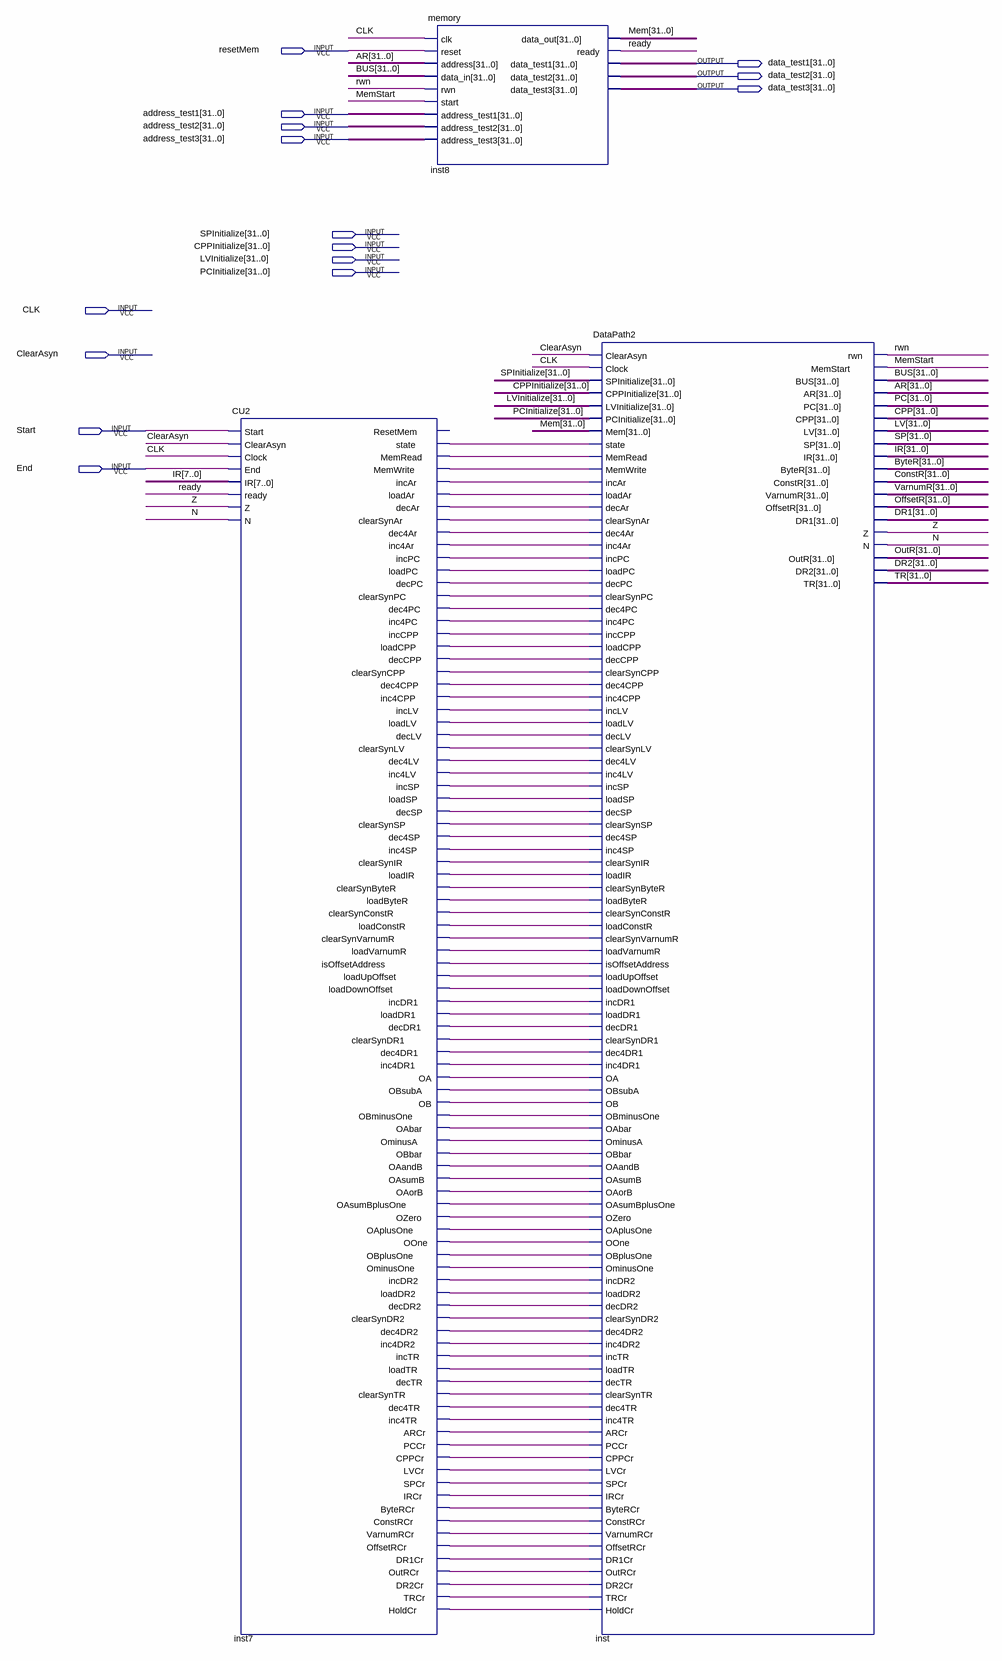
[diagram p0: schematic sheet]
// Quartus schematic cpu3.bdf as structural Verilog: 3 symbols, 15 pins
module cpu3 (
  input  resetMem,
  input  [31:0] address_test1,
  input  [31:0] address_test2,
  input  [31:0] address_test3,
  input  [31:0] SPInitialize,
  input  [31:0] CPPInitialize,
  input  [31:0] LVInitialize,
  input  [31:0] PCInitialize,
  input  CLK,
  input  ClearAsyn,
  input  Start,
  input  End,
  output [31:0] data_test1,
  output [31:0] data_test2,
  output [31:0] data_test3
);

  wire inst7_arcr, inst7_bytercr, inst7_clearsynar, inst7_clearsynbyter, inst7_clearsynconstr,
       inst7_clearsyncpp, inst7_clearsyndr1, inst7_clearsyndr2, inst7_clearsynir, inst7_clearsynlv,
       inst7_clearsynpc, inst7_clearsynsp, inst7_clearsyntr, inst7_clearsynvarnumr, inst7_constrcr,
       inst7_cppcr, inst7_dec4ar, inst7_dec4cpp, inst7_dec4dr1, inst7_dec4dr2, inst7_dec4lv, inst7_dec4pc,
       inst7_dec4sp, inst7_dec4tr, inst7_decar, inst7_deccpp, inst7_decdr1, inst7_decdr2, inst7_declv,
       inst7_decpc, inst7_decsp, inst7_dectr, inst7_dr1cr, inst7_dr2cr, inst7_holdcr, inst7_inc4ar,
       inst7_inc4cpp, inst7_inc4dr1, inst7_inc4dr2, inst7_inc4lv, inst7_inc4pc, inst7_inc4sp, inst7_inc4tr,
       inst7_incar, inst7_inccpp, inst7_incdr1, inst7_incdr2, inst7_inclv, inst7_incpc, inst7_incsp,
       inst7_inctr, inst7_ircr, inst7_isoffsetaddress, inst7_loadar, inst7_loadbyter, inst7_loadconstr,
       inst7_loadcpp, inst7_loaddownoffset, inst7_loaddr1, inst7_loaddr2, inst7_loadir, inst7_loadlv,
       inst7_loadpc, inst7_loadsp, inst7_loadtr, inst7_loadupoffset, inst7_loadvarnumr, inst7_lvcr,
       inst7_memread, inst7_memwrite, inst7_oa, inst7_oaandb, inst7_oabar, inst7_oaorb, inst7_oaplusone,
       inst7_oasumb, inst7_oasumbplusone, inst7_ob, inst7_obbar, inst7_obminusone, inst7_obplusone,
       inst7_obsuba, inst7_offsetrcr, inst7_ominusa, inst7_ominusone, inst7_oone, inst7_outrcr, inst7_ozero,
       inst7_pccr, inst7_spcr, inst7_state, inst7_trcr, inst7_varnumrcr, MemStart, N, ready, rwn, Z;
  wire [31:0] AR, BUS, ByteR, ConstR, CPP, DR1, DR2, IR, LV, Mem, OffsetR, OutR, PC, SP, TR, VarnumR;

  CU2 inst7 (
    .Start(Start), .ClearAsyn(ClearAsyn), .Clock(CLK), .End(End), .IR(IR[7:0]), .ready(ready), .Z(Z), .N(N),
    .state(inst7_state), .MemRead(inst7_memread), .MemWrite(inst7_memwrite), .incAr(inst7_incar),
    .loadAr(inst7_loadar), .decAr(inst7_decar), .clearSynAr(inst7_clearsynar), .dec4Ar(inst7_dec4ar),
    .inc4Ar(inst7_inc4ar), .incPC(inst7_incpc), .loadPC(inst7_loadpc), .decPC(inst7_decpc),
    .clearSynPC(inst7_clearsynpc), .dec4PC(inst7_dec4pc), .inc4PC(inst7_inc4pc), .incCPP(inst7_inccpp),
    .loadCPP(inst7_loadcpp), .decCPP(inst7_deccpp), .clearSynCPP(inst7_clearsyncpp), .dec4CPP(inst7_dec4cpp),
    .inc4CPP(inst7_inc4cpp), .incLV(inst7_inclv), .loadLV(inst7_loadlv), .decLV(inst7_declv),
    .clearSynLV(inst7_clearsynlv), .dec4LV(inst7_dec4lv), .inc4LV(inst7_inc4lv), .incSP(inst7_incsp),
    .loadSP(inst7_loadsp), .decSP(inst7_decsp), .clearSynSP(inst7_clearsynsp), .dec4SP(inst7_dec4sp),
    .inc4SP(inst7_inc4sp), .clearSynIR(inst7_clearsynir), .loadIR(inst7_loadir),
    .clearSynByteR(inst7_clearsynbyter), .loadByteR(inst7_loadbyter), .clearSynConstR(inst7_clearsynconstr),
    .loadConstR(inst7_loadconstr), .clearSynVarnumR(inst7_clearsynvarnumr), .loadVarnumR(inst7_loadvarnumr),
    .isOffsetAddress(inst7_isoffsetaddress), .loadUpOffset(inst7_loadupoffset),
    .loadDownOffset(inst7_loaddownoffset), .incDR1(inst7_incdr1), .loadDR1(inst7_loaddr1),
    .decDR1(inst7_decdr1), .clearSynDR1(inst7_clearsyndr1), .dec4DR1(inst7_dec4dr1), .inc4DR1(inst7_inc4dr1),
    .OA(inst7_oa), .OBsubA(inst7_obsuba), .OB(inst7_ob), .OBminusOne(inst7_obminusone), .OAbar(inst7_oabar),
    .OminusA(inst7_ominusa), .OBbar(inst7_obbar), .OAandB(inst7_oaandb), .OAsumB(inst7_oasumb),
    .OAorB(inst7_oaorb), .OAsumBplusOne(inst7_oasumbplusone), .OZero(inst7_ozero),
    .OAplusOne(inst7_oaplusone), .OOne(inst7_oone), .OBplusOne(inst7_obplusone), .OminusOne(inst7_ominusone),
    .incDR2(inst7_incdr2), .loadDR2(inst7_loaddr2), .decDR2(inst7_decdr2), .clearSynDR2(inst7_clearsyndr2),
    .dec4DR2(inst7_dec4dr2), .inc4DR2(inst7_inc4dr2), .incTR(inst7_inctr), .loadTR(inst7_loadtr),
    .decTR(inst7_dectr), .clearSynTR(inst7_clearsyntr), .dec4TR(inst7_dec4tr), .inc4TR(inst7_inc4tr),
    .ARCr(inst7_arcr), .PCCr(inst7_pccr), .CPPCr(inst7_cppcr), .LVCr(inst7_lvcr), .SPCr(inst7_spcr),
    .IRCr(inst7_ircr), .ByteRCr(inst7_bytercr), .ConstRCr(inst7_constrcr), .VarnumRCr(inst7_varnumrcr),
    .OffsetRCr(inst7_offsetrcr), .DR1Cr(inst7_dr1cr), .OutRCr(inst7_outrcr), .DR2Cr(inst7_dr2cr),
    .TRCr(inst7_trcr), .HoldCr(inst7_holdcr));  // open: ResetMem
  memory inst8 (
    .clk(CLK), .reset(resetMem), .address(AR), .data_in(BUS), .rwn(rwn), .start(MemStart),
    .address_test1(address_test1), .address_test2(address_test2), .address_test3(address_test3),
    .data_out(Mem), .ready(ready), .data_test1(data_test1), .data_test2(data_test2), .data_test3(data_test3));
  DataPath2 inst (
    .ClearAsyn(ClearAsyn), .Clock(CLK), .SPInitialize(SPInitialize), .CPPInitialize(CPPInitialize),
    .LVInitialize(LVInitialize), .PCInitialize(PCInitialize), .Mem(Mem), .state(inst7_state),
    .MemRead(inst7_memread), .MemWrite(inst7_memwrite), .incAr(inst7_incar), .loadAr(inst7_loadar),
    .decAr(inst7_decar), .clearSynAr(inst7_clearsynar), .dec4Ar(inst7_dec4ar), .inc4Ar(inst7_inc4ar),
    .incPC(inst7_incpc), .loadPC(inst7_loadpc), .decPC(inst7_decpc), .clearSynPC(inst7_clearsynpc),
    .dec4PC(inst7_dec4pc), .inc4PC(inst7_inc4pc), .incCPP(inst7_inccpp), .loadCPP(inst7_loadcpp),
    .decCPP(inst7_deccpp), .clearSynCPP(inst7_clearsyncpp), .dec4CPP(inst7_dec4cpp), .inc4CPP(inst7_inc4cpp),
    .incLV(inst7_inclv), .loadLV(inst7_loadlv), .decLV(inst7_declv), .clearSynLV(inst7_clearsynlv),
    .dec4LV(inst7_dec4lv), .inc4LV(inst7_inc4lv), .incSP(inst7_incsp), .loadSP(inst7_loadsp),
    .decSP(inst7_decsp), .clearSynSP(inst7_clearsynsp), .dec4SP(inst7_dec4sp), .inc4SP(inst7_inc4sp),
    .clearSynIR(inst7_clearsynir), .loadIR(inst7_loadir), .clearSynByteR(inst7_clearsynbyter),
    .loadByteR(inst7_loadbyter), .clearSynConstR(inst7_clearsynconstr), .loadConstR(inst7_loadconstr),
    .clearSynVarnumR(inst7_clearsynvarnumr), .loadVarnumR(inst7_loadvarnumr),
    .isOffsetAddress(inst7_isoffsetaddress), .loadUpOffset(inst7_loadupoffset),
    .loadDownOffset(inst7_loaddownoffset), .incDR1(inst7_incdr1), .loadDR1(inst7_loaddr1),
    .decDR1(inst7_decdr1), .clearSynDR1(inst7_clearsyndr1), .dec4DR1(inst7_dec4dr1), .inc4DR1(inst7_inc4dr1),
    .OA(inst7_oa), .OBsubA(inst7_obsuba), .OB(inst7_ob), .OBminusOne(inst7_obminusone), .OAbar(inst7_oabar),
    .OminusA(inst7_ominusa), .OBbar(inst7_obbar), .OAandB(inst7_oaandb), .OAsumB(inst7_oasumb),
    .OAorB(inst7_oaorb), .OAsumBplusOne(inst7_oasumbplusone), .OZero(inst7_ozero),
    .OAplusOne(inst7_oaplusone), .OOne(inst7_oone), .OBplusOne(inst7_obplusone), .OminusOne(inst7_ominusone),
    .incDR2(inst7_incdr2), .loadDR2(inst7_loaddr2), .decDR2(inst7_decdr2), .clearSynDR2(inst7_clearsyndr2),
    .dec4DR2(inst7_dec4dr2), .inc4DR2(inst7_inc4dr2), .incTR(inst7_inctr), .loadTR(inst7_loadtr),
    .decTR(inst7_dectr), .clearSynTR(inst7_clearsyntr), .dec4TR(inst7_dec4tr), .inc4TR(inst7_inc4tr),
    .ARCr(inst7_arcr), .PCCr(inst7_pccr), .CPPCr(inst7_cppcr), .LVCr(inst7_lvcr), .SPCr(inst7_spcr),
    .IRCr(inst7_ircr), .ByteRCr(inst7_bytercr), .ConstRCr(inst7_constrcr), .VarnumRCr(inst7_varnumrcr),
    .OffsetRCr(inst7_offsetrcr), .DR1Cr(inst7_dr1cr), .OutRCr(inst7_outrcr), .DR2Cr(inst7_dr2cr),
    .TRCr(inst7_trcr), .HoldCr(inst7_holdcr), .rwn(rwn), .MemStart(MemStart), .BUS(BUS), .AR(AR), .PC(PC),
    .CPP(CPP), .LV(LV), .SP(SP), .IR(IR), .ByteR(ByteR), .ConstR(ConstR), .VarnumR(VarnumR),
    .OffsetR(OffsetR), .DR1(DR1), .Z(Z), .N(N), .OutR(OutR), .DR2(DR2), .TR(TR));
endmodule
